# Altium schematic sheet DSO_IO.SchDoc: Schematic_Name
size A4; CompanyName: University of Melbourne; Engineer: Your Name Here; DocumentNumber: 1; Revision: 0.1; SheetNumber: 10; SheetTotal: 11; Title_Project: Project_Title; StudentNo: Student No.
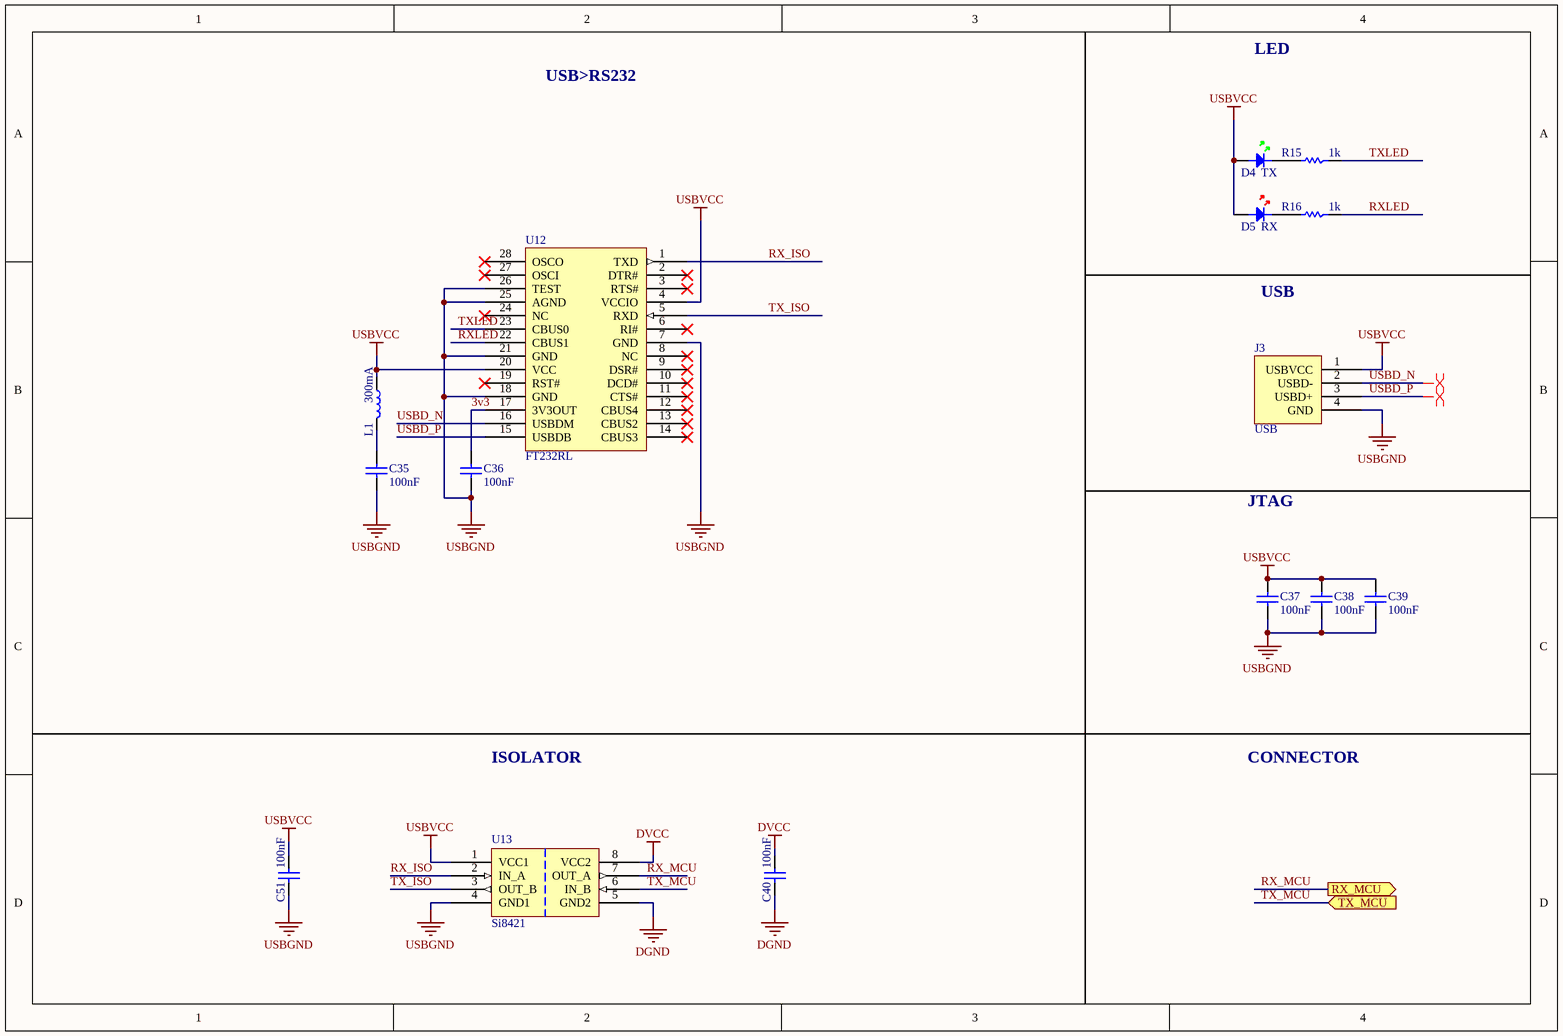
[diagram p0: DSO_IO.SchDoc]

## Parts
C35  100nF  [0805C]
C36  100nF  [0805C]
C37  100nF  [0805C]
C38  100nF  [0805C]
C39  100nF  [0805C]
C40  100nF  [0805C]
C51  100nF  [0805C]
D4  TX  [0805D-GREEN]
D5  RX  [0805D-RED]
J3  USB  [USBPLUG]
L1  300mA  [0805]
R15  1k  [0805]
R16  1k  [0805]
U12  FT232RL  [SSOP-28]
U13  Si8421  [SOIC-8]

## Ports
RX_MCU (out), TX_MCU (in)

## Nets
DGND: C40.2 U13.5(GND2)
DVCC: C40.1 U13.8(VCC2)
USBGND: C35.2 C36.2 C37.2 C38.2 C39.2 C51.2 J3.4(GND) U12.7(GND) U12.18(GND) U12.21(GND) U12.25(AGND) U12.26(TEST) U13.4(GND1)
USBVCC: C37.1 C38.1 C39.1 C51.1 D4.A D5.A J3.1(USBVCC) L1.1 U12.4(VCCIO) U12.20(VCC) U13.1(VCC1)
3v3: C36.1 U12.17(3V3OUT)
RX_ISO: U12.1(TXD) U13.2(IN_A)
RX_MCU: U13.7(OUT_A) ; port RX_MCU
RXLED: R16.1 U12.22(CBUS1)
TX_ISO: U12.5(RXD) U13.3(OUT_B)
TX_MCU: U13.6(IN_B) ; port TX_MCU
TXLED: R15.1 U12.23(CBUS0)
USBD_N: J3.2(USBD-) U12.16(USBDM)
USBD_P: J3.3(USBD+) U12.15(USBDB)
NetC35_1: C35.1 L1.2
NetD4_K: D4.K R15.2
NetD5_K: D5.K R16.2

Not connected (* = marked no-connect by the designer): U12 2(DTR#)* 3(RTS#)* 6(RI#)* 8(NC)* 9(DSR#)* 10(DCD#)* 11(CTS#)* 12(CBUS4)* 13(CBUS2)* 14(CBUS3)* 19(RST#)* 24(NC)* 27(OSCI)* 28(OSCO)*

## Layout directives
differential pair: USBD_N, USBD_P

## Notes on the sheet
- USB>RS232
- LED
- USB
- JTAG
- ISOLATOR
- CONNECTOR

## Library data of the parts
C35-C40 C51 = C: Capacitor; Reviewed by: RM - 2018/08/05; Revision: July-2002: Re-released for DXP Platform.; Value: 100nF; Supplier 1: *; Supplier Part Number 1: *
D4 = LED GREEN: Light Emitting Diode; Reviewed by: RM - 2018/08/05; Revision: July-2002: Re-released for DXP Platform.; Supplier 1: Digi-Key; Supplier Part Number 1: 160-1423-1-ND
D5 = LED RED: Light Emitting Diode; Reviewed by: RM - 2018/08/05; Revision: July-2002: Re-released for DXP Platform.; Supplier 1: Digi-Key; Supplier Part Number 1: 475-1415-1-ND
J3 = USBPLUG: USB B Type Connector; Reviewed by: RM - 2018/08/05; Supplier 1: Digi-Key; Supplier Part Number 1: 609-1039-ND
L1 = I: Inductor; Reviewed by: RM - 2018/08/05; Value: 300mA; Supplier 1: *; Supplier Part Number 1: *
R15 R16 = R: Resistor; Reviewed by: RM - 2018/08/05; Value: 1k; Supplier 1: *; Suppler Part Number 1: *
U12 = FT232RL: USB to Serial bridge; Reviewed by: RM - 2018/08/05; Supplier 1: Digi-Key; Supplier Part Number 1: 768-1007-1-ND
U13 = Si8421: Dual Channel Digital Isolator Both Ways; Reviewed by: RM - 2018/08/05; Supplier 1: Digi-Key; Supplier Part Number 1: 336-1755-5-ND